# EAGLE schematic compressor_poc (EAGLE 9.6.2)
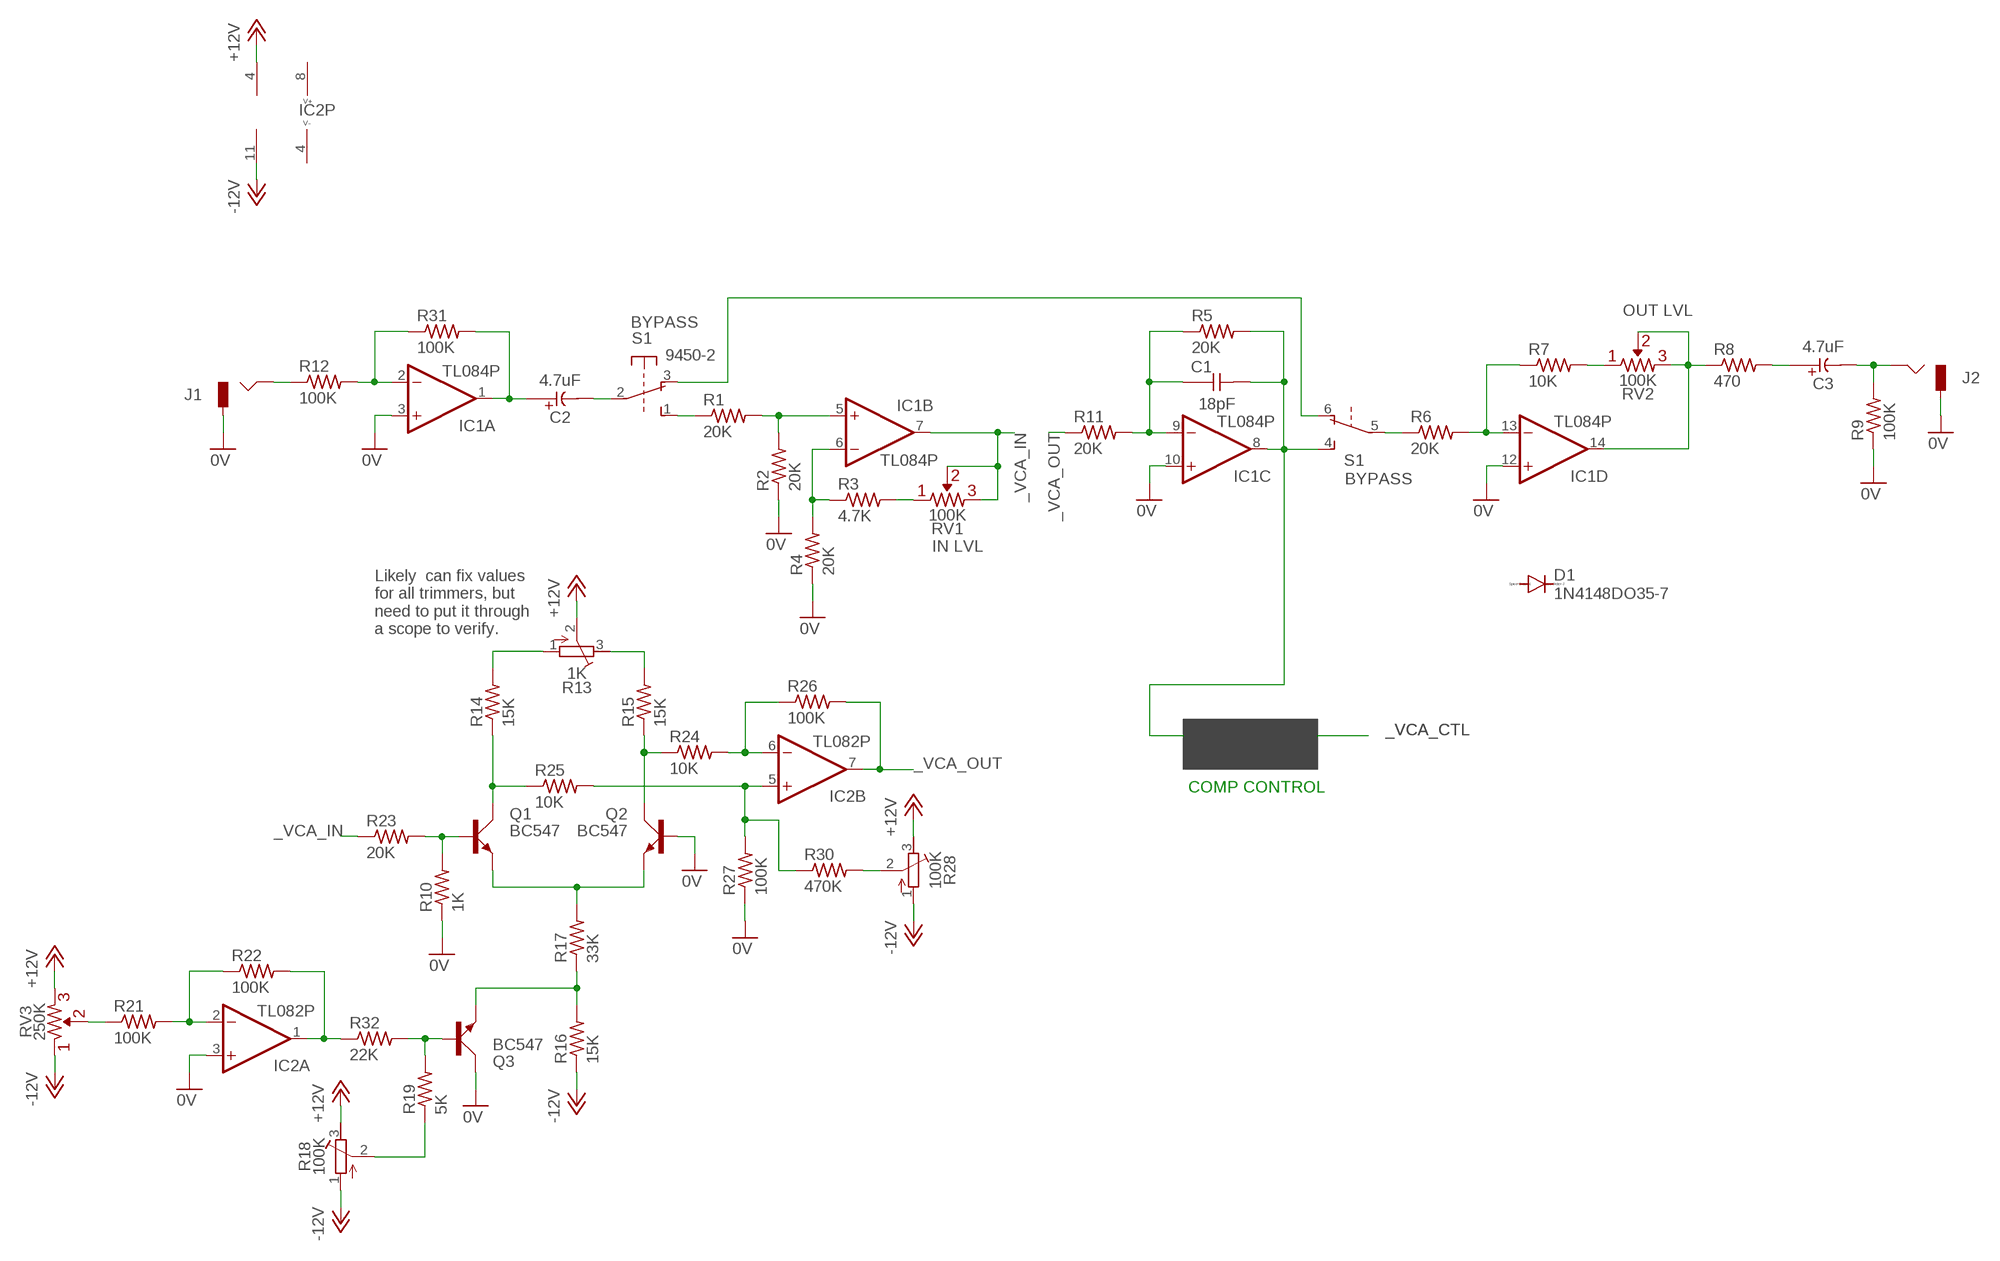
[diagram p0: schematic, sheet 1]

## Parts
C1  18pF  CC-US025-024X044  [C025-024X044]
C2  4.7uF  CE-USE2-5  [E2-5]
C3  4.7uF  CE-USE2-5  [E2-5]
D1  1N4148DO35-7  [DO35-7]
IC1  TL084P  [DIL14]
IC2  TL082P  [DIL08]
J1  JACK-M  [JACK-M]
J2  JACK-M  [JACK-M]
Q1  BC547  [SOT54A]
Q2  BC547  [SOT54A]
Q3  BC547  [SOT54A]
R1  20K  R-US_0204/7  [0204/7]
R2  20K  R-US_0204/7  [0204/7]
R3  4.7K  R-US_0204/7  [0204/7]
R4  20K  R-US_0204/7  [0204/7]
R5  20K  R-US_0204/7  [0204/7]
R6  20K  R-US_0204/7  [0204/7]
R7  10K  R-US_0204/7  [0204/7]
R8  470  R-US_0204/7  [0204/7]
R9  100K  R-US_0204/7  [0204/7]
R10  1K  R-US_0204/7  [0204/7]
R11  20K  R-US_0204/7  [0204/7]
R12  100K  R-US_0204/7  [0204/7]
R13  1K  R-TRIMM3304W  [RTRIM3304W]
R14  15K  R-US_0204/7  [0204/7]
R15  15K  R-US_0204/7  [0204/7]
R16  15K  R-US_0204/7  [0204/7]
R17  33K  R-US_0204/7  [0204/7]
R18  100K  R-TRIMM3304W  [RTRIM3304W]
R19  5K  R-US_0204/7  [0204/7]
R21  100K  R-US_0204/7  [0204/7]
R22  100K  R-US_0204/7  [0204/7]
R23  20K  R-US_0204/7  [0204/7]
R24  10K  R-US_0204/7  [0204/7]
R25  10K  R-US_0204/7  [0204/7]
R26  100K  R-US_0204/7  [0204/7]
R27  100K  R-US_0204/7  [0204/7]
R28  100K  R-TRIMM3304W  [RTRIM3304W]
R30  470K  R-US_0204/7  [0204/7]
R31  100K  R-US_0204/7  [0204/7]
R32  22K  R-US_0204/7  [0204/7]
RV1  100K  R-VAR  [R-VAR]
RV2  100K  R-VAR  [R-VAR]
RV3  250K  R-VAR  [R-VAR]
S1  9450-2  [9450-2]

## Nets
0V: IC1.3(A:+IN) IC1.10(C:+IN) IC1.12(D:+IN) IC2.3(A:+IN) J1.GND J2.GND Q2.B Q3.C R2.1 R4.1 R9.1 R10.1 R27.1
+12V: IC1.4(P:V+) R13.2(S) R18.3(A) R28.3(A) RV3.R2
-12V: IC1.11(P:V-) R16.1 R18.1(E) R28.1(E) RV3.R1
_VCA_IN: IC1.7(B:OUT) R23.1 RV1.R2 RV1.VAR
_VCA_OUT: IC2.7(B:OUT) R11.1 R26.2
N$1: R13.1(E) R14.2
N$2: IC1.5(B:+IN) R1.2 R2.2
N$3: R3.2 RV1.R1
N$4: IC1.6(B:-IN) R3.1 R4.2
N$5: R1.1 S1.1(1:S)
N$6: C2.- S1.2(1:P)
N$7: J1.HOT R12.1
N$8: C1.2 IC1.8(C:OUT) R5.2 S1.4(2:S)
N$9: S1.3(1:O) S1.6(2:O)
N$10: IC1.13(D:-IN) R6.2 R7.1
N$11: R7.2 RV2.R1
N$12: IC1.14(D:OUT) R8.1 RV2.R2 RV2.VAR
N$13: R6.1 S1.5(2:P)
N$14: C3.+ R8.2
N$15: C3.- J2.HOT R9.2
N$16: C2.+ IC1.1(A:OUT) R31.2
N$18: IC1.2(A:-IN) R12.2 R31.1
N$19: C1.1 IC1.9(C:-IN) R5.1 R11.2
N$20: R13.3(A) R15.2
N$21: Q2.C R15.1 R24.1
N$22: Q1.C R14.1 R25.1
N$23: Q1.E Q2.E R17.2
N$24: Q3.E R16.2 R17.1
N$25: Q3.B R19.2 R32.2
N$26: IC2.1(A:OUT) R22.2 R32.1
N$27: R18.2(S) R19.1
N$28: IC2.2(A:-IN) R21.2 R22.1
N$29: R21.1 RV3.VAR
N$30: Q1.B R10.2 R23.2
N$31: IC2.5(B:+IN) R25.2 R27.2 R30.1
N$32: R28.2(S) R30.2
N$33: IC2.6(B:-IN) R24.2 R26.1
Unconnected: D1.A D1.C

## Notes on the sheet
- OUT LVL
- BYPASS
- BYPASS
- IN LVL
- Likely  can fix values
  for all trimmers, but 
  need to put it through 
  a scope to verify.
- COMP CONTROL

## Power pins joined to a net without a drawn wire
V+: IC2.8(P:V+)
V-: IC2.4(P:V-)

## Library data of the parts
C1 = _common.v1:CC-US: CAPACITOR, US symbol
C2 C3 = _common.v1:CE-US: ELECTROLYTIC CAPACITOR, US symbol
D1 = diode:1N4148: DIODE high speed (Philips)
IC1 = linear:TL084: OP AMP
IC2 = _common:TL082: OP AMP
J1 J2 = _common:JACK-M
Q1-Q3 = transistor-small-signal:BC547: NPN TRANSISTOR
R1-R12 R14-R17 R19 R21-R27 R30-R32 = rcl:R-US_: RESISTOR, American symbol; SPICEPREFIX: R
R13 R18 R28 = _common:R-TRIMM: Trimm resistor
RV1-RV3 = _common:R-VAR
S1 = switch-misc:9450-2: MARQUARDT SWITCH